# EasyEDA Pro project usbhub.epro

# Schematic Schematic1
Board Name: Board1; Create Date: 2024-12-30; Page Name: P1; Project Name: usb; Schematic Name: Schematic1; Update Date: 2025-01-01; Company: 嘉立创EDA; Page Size: A4; Version: V1.0
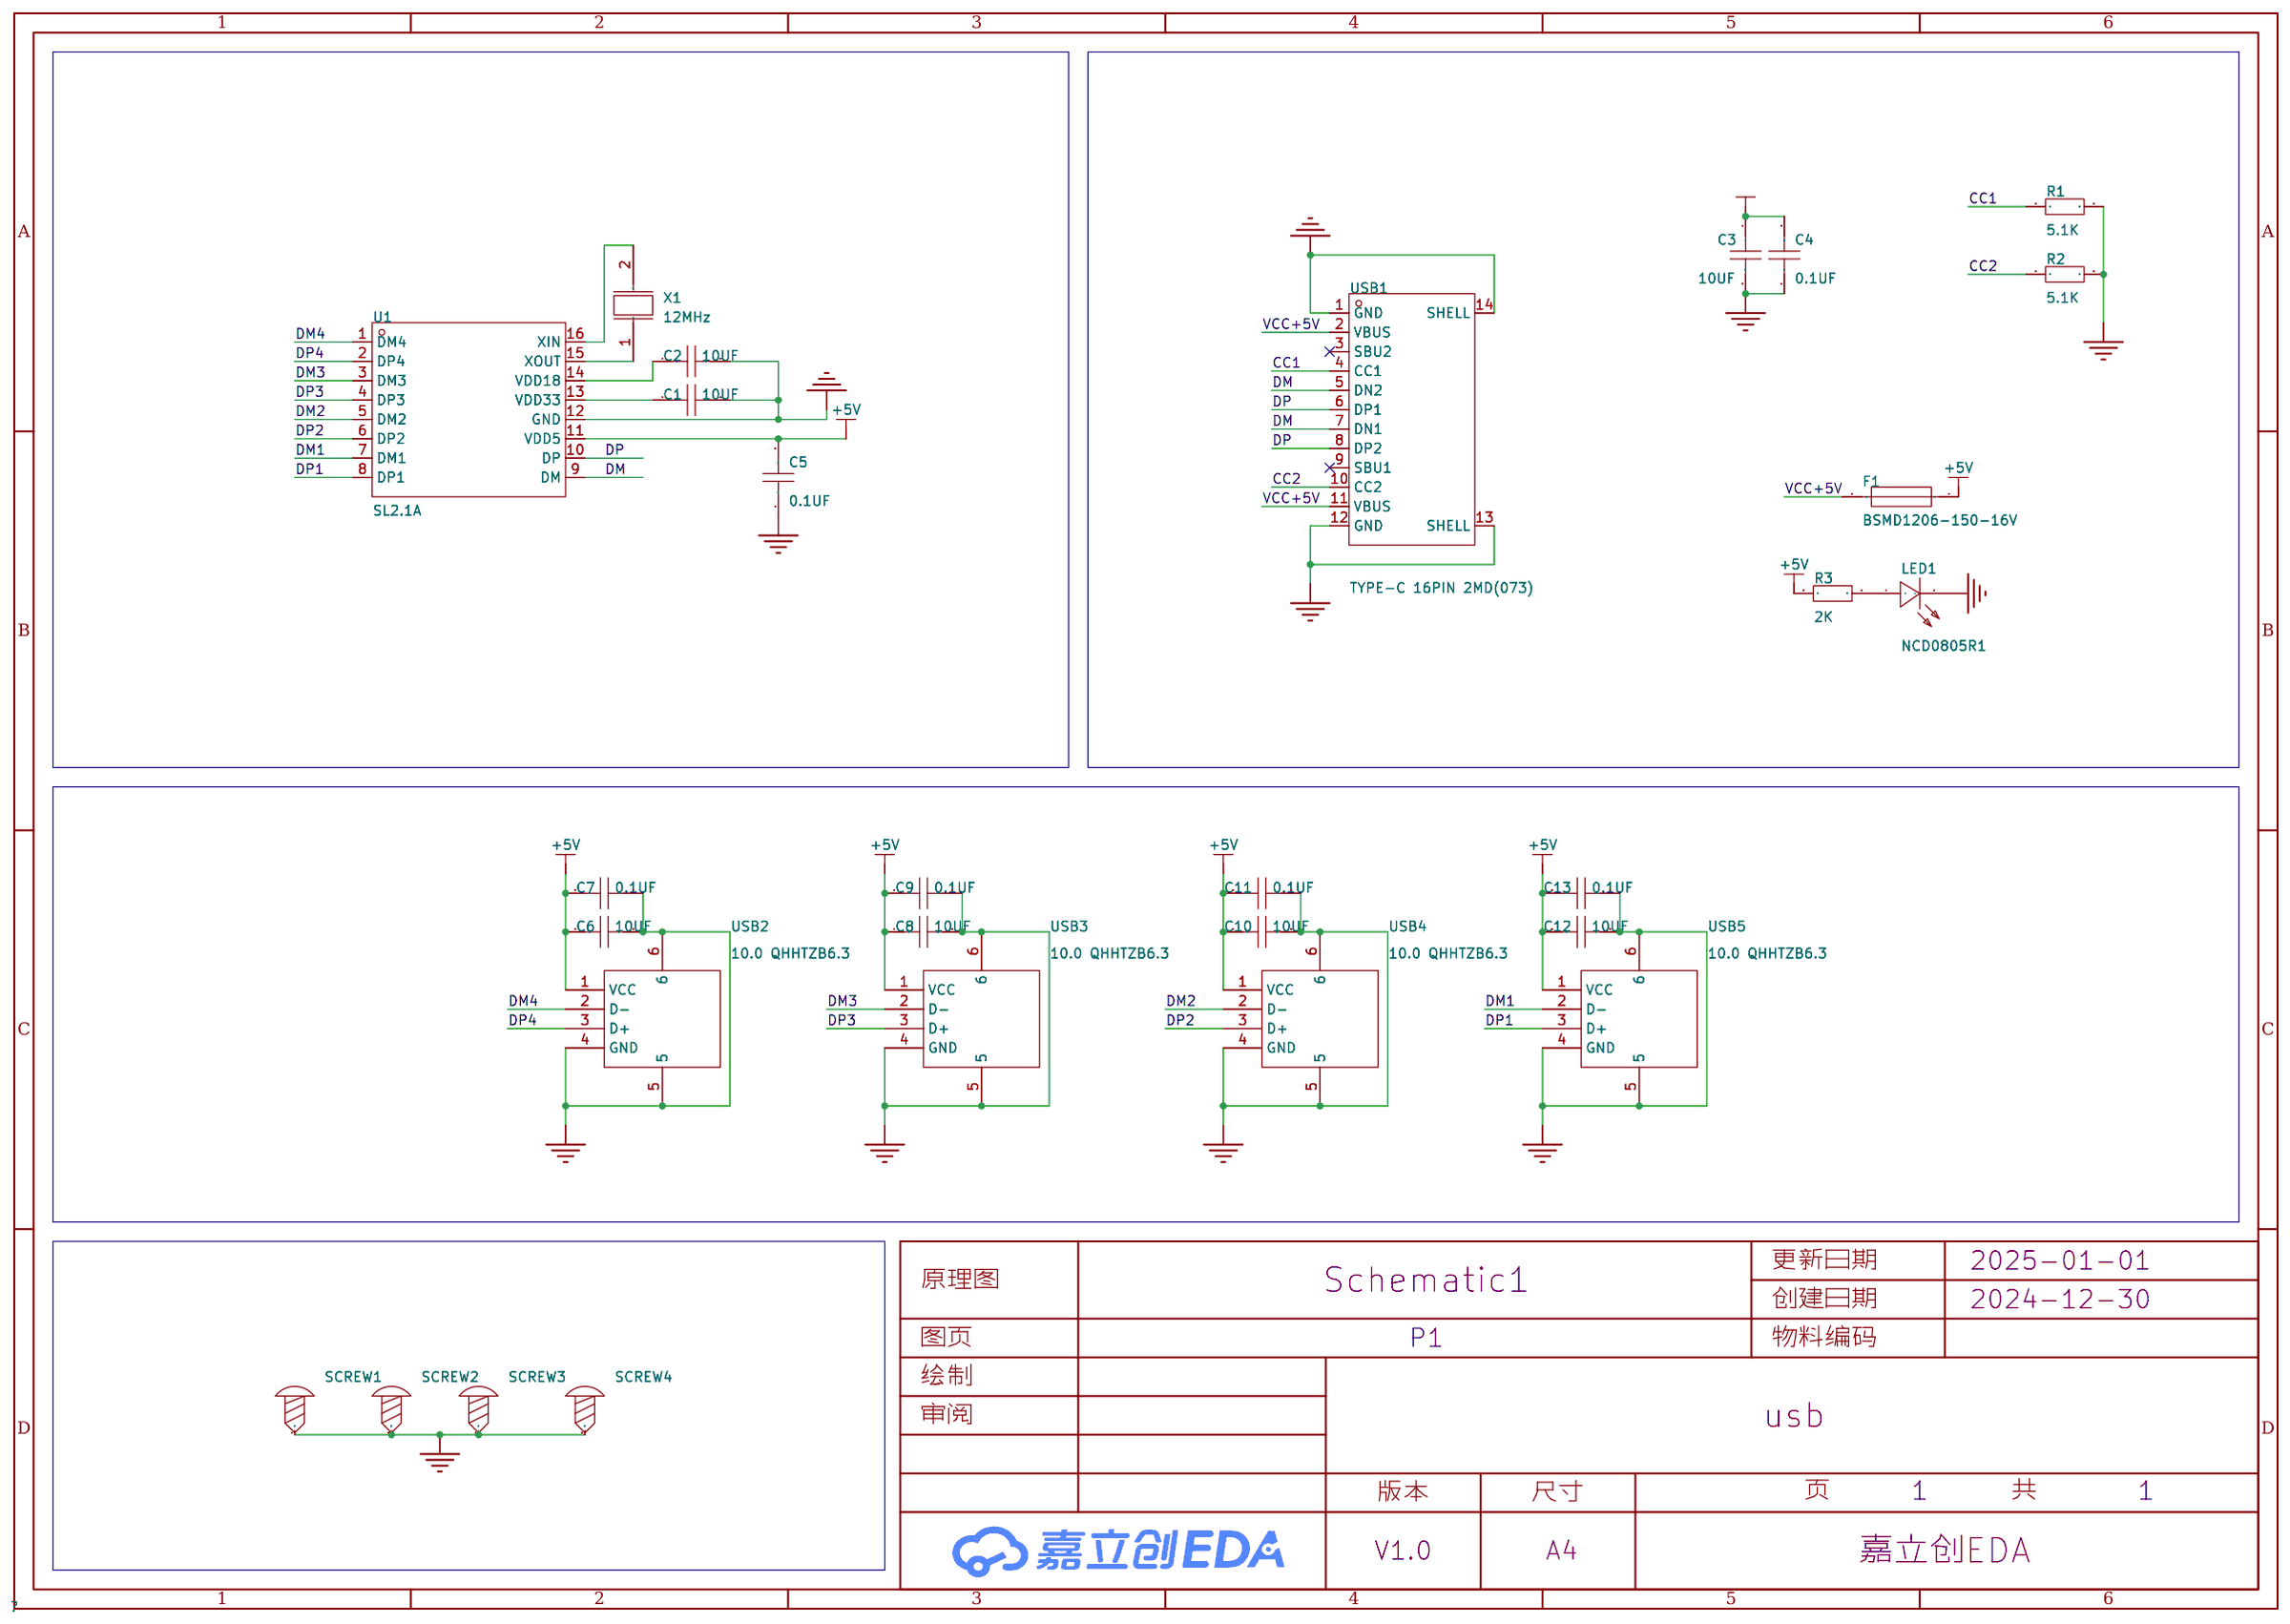
[diagram p0: schematic sheet]

## Parts
C1  10UF  [C0805]
C2  10UF  [C0805]
C3  10UF  [C0805]
C4  0.1UF  [C0805]
C5  0.1UF  [C0805]
C6  10UF  [C0805]
C7  0.1UF  [C0805]
C8  10UF  [C0805]
C9  0.1UF  [C0805]
C10  10UF  [C0805]
C11  0.1UF  [C0805]
C12  10UF  [C0805]
C13  0.1UF  [C0805]
F1  BSMD1206-150-16V  [F1206]
LED1  NCD0805R1  [LED0805-R-RD]
R1  5.1K  [R0805]
R2  5.1K  [R0805]
R3  2K  [R0805]
SCREW1  -  [M2螺丝]
SCREW2  -  [M2螺丝]
SCREW3  -  [M2螺丝]
SCREW4  -  [M2螺丝]
U1  SL2.1A  [SOP-16_L10.0-W3.9-P1.27-LS6.0-BL]
USB1  TYPE-C 16PIN 2MD(073)  [USB-C-SMD_TYPE-C-6PIN-2MD-073]
USB2  10.0 QHHTZB6.3  [USB-A-TH_10.0QHHTZB6.3]
USB3  10.0 QHHTZB6.3  [USB-A-TH_10.0QHHTZB6.3]
USB4  10.0 QHHTZB6.3  [USB-A-TH_10.0QHHTZB6.3]
USB5  10.0 QHHTZB6.3  [USB-A-TH_10.0QHHTZB6.3]
X1  12MHz  [CRYSTAL-SMD_L5.0-W3.2-1-A]

## Library data of the parts
C1-C13 = CAP_0805: Supplier Footprint: 0805
F1 = BSMD1206-150-16V: 最大电压:16V;最大电流:40A;保持电流:1.5A;跳闸电流:3A;; LCSC Part Name: 16V 1.5A 1206自恢复; Supplier Part: C883133; Manufacturer: BHFUSE(佰宏); Supplier Footprint: 1206; JLCPCB Part Class: 扩展库; Datasheet: https://atta.szlcsc.com/upload/public/pdf/source/20230512/E419278EC8529AAF514173EF221BCF4B.pdf; Supplier: LCSC; Operating Voltage (Max): 16V; Current Rating (Max): 40A; Hold Current: 1.5A; Trip Current: 3A; Power Dissipation: 1W; Resistance - Initial (Ri) (Min): 25mΩ; Resistance - Post Trip (R1) (Max): 130mΩ; Maximum Time to Trip: 300ms; Operating Temperature: -40℃~+85℃
LED1 = NCD0805R1: 灯头类型:-;发光颜色:红色;正向电压(VF):1.6V~2.6V;功率:65mW;正向电流:20mA;主波长:615nm~630nm;二极管配置:独立二极管;透镜颜色:无色透明透镜;色温:-;发光强度:67mcd~195mcd;发光角度:130°;载带方式:-;工作温度:-30℃~+85℃;; Supplier Part: C84256; Manufacturer: 国星光电; Supplier Footprint: 0805; JLCPCB Part Class: 基础库; Datasheet: https://atta.szlcsc.com/upload/public/pdf/source/20200820/C84256_F0A75A43B3EAD75808600A0514C76B99.pdf; Supplier: LCSC; Emitted Color: 红色; Forward Voltage (VF): 1.6V~2.6V; Power Dissipation: 65mW; Forward Current: 20mA; Dominant Wavelength: 615nm~630nm; Diode Configuration: 独立二极管; Lens Color: 无色透明透镜; Luminous Intensity: 67mcd~195mcd; Viewing Angle: 130°; Operating Temperature: -30℃~+85℃
R1-R3 = Res_0805: Supplier Footprint: 0805
SCREW1-SCREW4 = M2螺丝: Supplier Footprint: 插件
U1 = SL2.1A: SL2.1A是一颗高集成度,高性能,低功耗的USB2.0集线器主控芯片，支持USB2.0高速(480MHz),全速(12MHz)和低速模式(1.5MHz)，内置12MHz晶体振荡器。; LCSC Part Name: USB2.0高速4端口HUB控制器; Supplier Part: C192893; Manufacturer: CoreChips(和芯润德); Supplier Footprint: SOP-16; JLCPCB Part Class: 扩展库; Datasheet: https://atta.szlcsc.com/upload/public/pdf/source/20180522/C192893_624110D24898D57AAC785E3DF98EA862.pdf; Supplier: LCSC
USB1 = TYPE-C 16PIN 2MD(073): 连接器类型:Type-C;标准:USB 3.1;公母:母;安装方式:卧贴;触点数量:16P;端口数量:1;额定电流 - 电源:5A;工作温度范围:-25℃~+85℃;; LCSC Part Name: Type-C 母 卧贴; Supplier Part: C2765186; Manufacturer: SHOU HAN(首韩); Supplier Footprint: SMD; JLCPCB Part Class: 扩展库; Datasheet: https://atta.szlcsc.com/upload/public/pdf/source/20211123/39B17C16241EAC15C5E277BDA434118E.pdf; Supplier: LCSC; Connector Type: Type-C; Standard: USB 3.1; Gender: 母; Mounting Style: 卧贴; Number of Contacts: 16P; Number of Ports: 1; Current Rating - Power (Max): 5A; Operating Temperature Range: -25℃~+85℃; Rated Voltage (Max): 5V; Connect-Disconnect Life: 5千次; Core Colour: 黑色
USB2-USB5 = 10.0 QHHTZB6.3: 连接器类型:Type-A;标准:USB 2.0;公母:母;安装方式:卧贴;触点数量:4P;端口数量:1;额定电流 - 电源:1.5A;工作温度范围:-25℃~+85℃;; LCSC Part Name: Type-A 母 卧贴; Supplier Part: C668591; Manufacturer: SHOU HAN(首韩); Supplier Footprint: SMD; JLCPCB Part Class: 扩展库; Datasheet: https://atta.szlcsc.com/upload/public/pdf/source/20200618/C668591_4974797655F912CB13E5351AD3DDB1B7.pdf; Supplier: LCSC; Connector Type: Type-A; Standard: USB 2.0; Gender: 母; Mounting Style: 卧贴; Number of Contacts: 4P; Number of Ports: 1; Current Rating - Power (Max): 1.5A; Rated Voltage (Max): 30V; Connect-Disconnect Life: 5千次; Length: 10mm; Core Colour: 黑色; Operating Temperature Range: -25℃~+85℃
X1 = G5312000202090: 晶振类型:贴片晶振;频率:12MHz;常温频差:±20ppm;外接负载电容:20pF;; LCSC Part Name: 12MHz ±20ppm 20pF; Supplier Part: C479171; Manufacturer: JGHC(晶光华); Supplier Footprint: SMD5032; JLCPCB Part Class: 扩展库; Datasheet: https://atta.szlcsc.com/upload/public/pdf/source/20200102/C479172_02E461FA3A6D6D7CC97069C24BD4D6B6.pdf; Supplier: LCSC; Crystal Type: 贴片晶振; Normal temperature Frequency Tolerance: ±20ppm; External load capacitor: 20pF; Equivalent Series Resistance (ESR): 90Ω; Operating Temperature: -40℃~+85℃

## Nets
+5V: C5.2 C6.1 C7.2 C8.1 C9.2 C10.1 C11.2 C12.1 C13.2 F1.2 R3.2 U1.11(VDD5) USB2.1(VCC) USB3.1(VCC) USB4.1(VCC) USB5.1(VCC)
GND: C1.2 C2.2 C3.2 C4.1 C5.1 C6.2 C7.1 C8.2 C9.1 C10.2 C11.1 C12.2 C13.1 LED1.2(-) R1.2 R2.2 SCREW1.1 SCREW2.1 SCREW3.1 SCREW4.1 U1.12(GND) USB1.1(GND) USB1.12(GND) USB1.13(SHELL) USB1.14(SHELL) USB2.4(GND) USB2.5 USB2.6 USB3.4(GND) USB3.5 USB3.6 USB4.4(GND) USB4.5 USB4.6 USB5.4(GND) USB5.5 USB5.6
VCC+5V: C3.1 C4.2 F1.1 USB1.2(VBUS) USB1.11(VBUS)
CC1: R1.1 USB1.4(CC1)
CC2: R2.1 USB1.10(CC2)
DM: U1.9(DM) USB1.5(DN2) USB1.7(DN1)
DM1: U1.7(DM1) USB5.2(D-)
DM2: U1.5(DM2) USB4.2(D-)
DM3: U1.3(DM3) USB3.2(D-)
DM4: U1.1(DM4) USB2.2(D-)
DP: U1.10(DP) USB1.6(DP1) USB1.8(DP2)
DP1: U1.8(DP1) USB5.3(D+)
DP2: U1.6(DP2) USB4.3(D+)
DP3: U1.4(DP3) USB3.3(D+)
DP4: U1.2(DP4) USB2.3(D+)
$1N795: C1.1 U1.13(VDD33)
$1N799: C2.1 U1.14(VDD18)
$1N892: U1.15(XOUT) X1.1
$1N896: U1.16(XIN) X1.2
$1N2196: LED1.1(+) R3.1

Not connected (* = marked no-connect by the designer): USB1 3(SBU2)* 9(SBU1)*

# Board PCB1
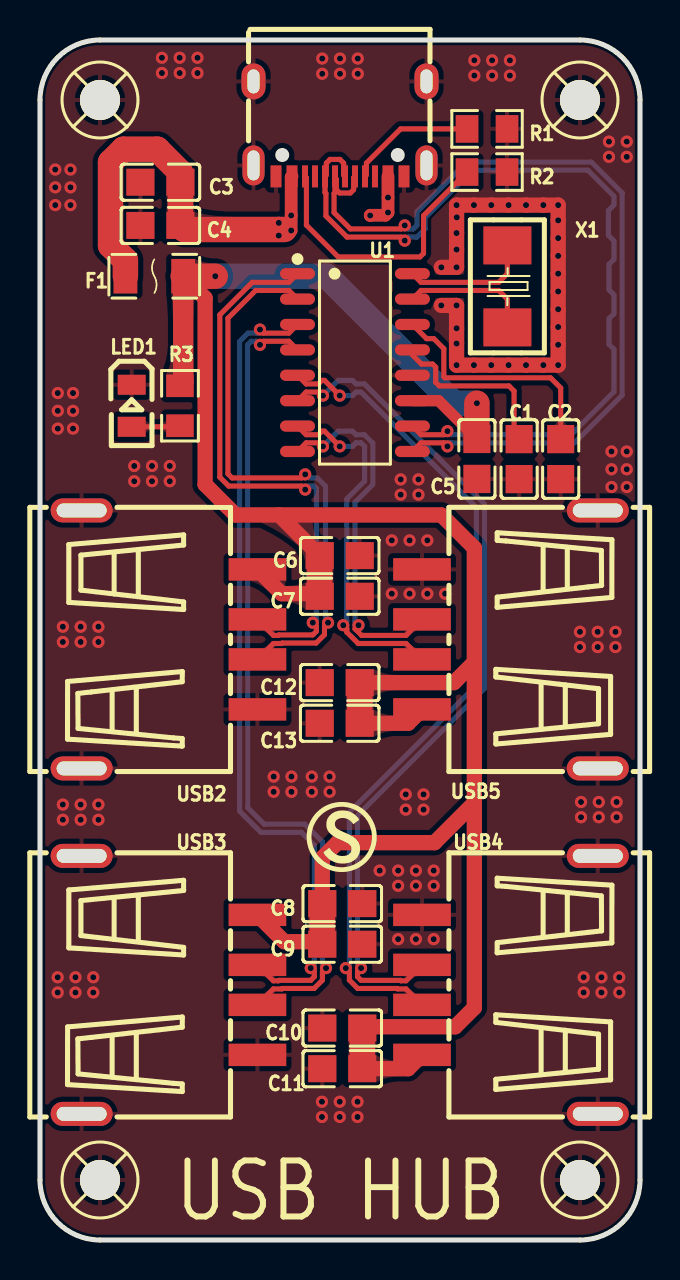
[diagram p1: board, top side]
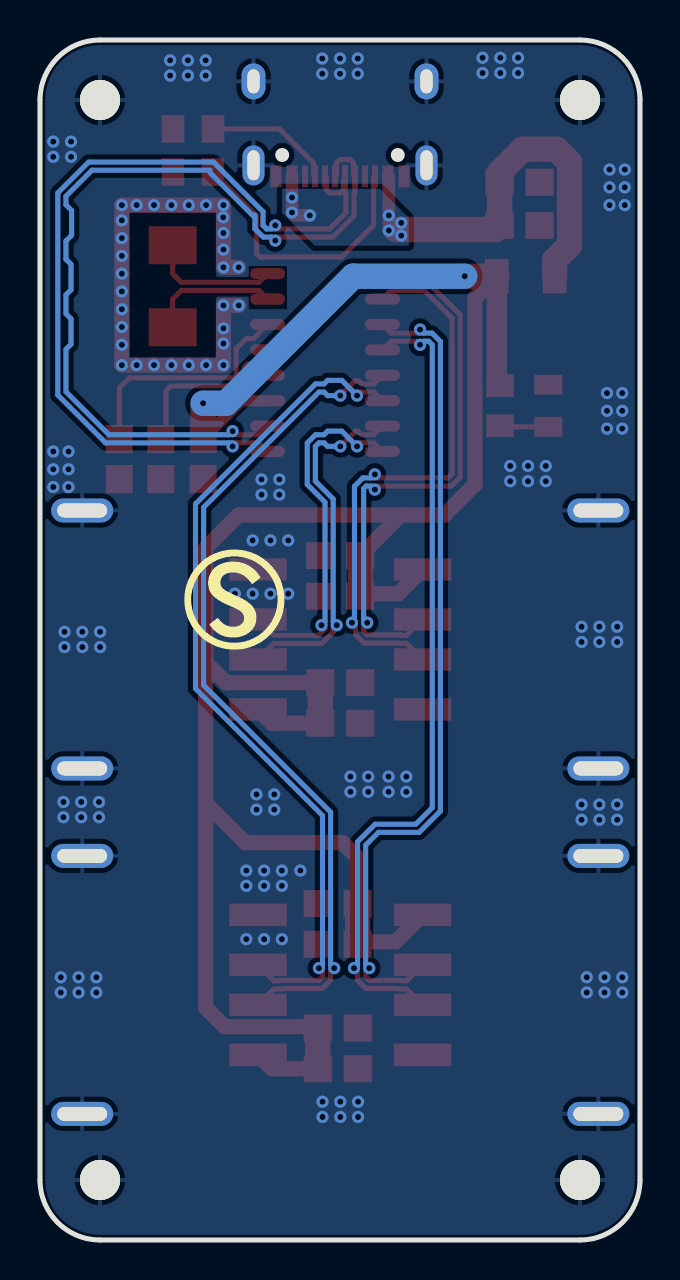
[diagram p2: board, bottom side, seen from below]

Outline 30 x 60 mm; copper layers: Top Layer, Bottom Layer. Coordinates in mm from the lower left corner of the outline.
Outline path: 0,57 0,3 arc(0.88,0.88) 3,0 27,0 arc(29.12,0.88) 30,3 30,57 arc(29.12,59.12) 27,60 3,60 arc(0.88,59.12) 0,57
Stack: Top Layer 0.035mm / Dielectric1 1.51mm FR4 er 4.5 / Bottom Layer 0.035mm

## Design rules (mm)
net DM4: DP4
net DP4: DP4
net DM3: DP3
net DP3: DP3
net DM2: DP2
net DP2: DP2
net DM1: DP1
net DP1: DP1
net $1N896: DP6
net $1N892: DP6
net DP: DP5
net DM: DP5
template: 自定义配置
spacing copperThickness1oz (default): track to track 0.102, other pairs 0.152 to 0.3
spacing copperThickness2oz: track to track 0.203, other pairs 0.152 to 0.3
track width copperThickness1oz (default): min 0.127, default 0.254, max 2.54
track width copperThickness2oz: min 0.203, default 0.254, max 2.54
differential pair differentialPair (default): width min 0.127, default 0.254, max 2.54; gap min 0.152, default 0.152
via viaSize (default): diameter min 0.5, default 0.61, max 10; hole min 0.3, default 0.305, max 6.299

## Placement (name value [footprint] x y rotation side)
C1  10UF  [C0805]  23.96 39.05 270 top
C2  10UF  [C0805]  26.03 39.05 270 top
C3  10UF  [C0805]  6.02 52.89 180 top
C4  0.1UF  [C0805]  6.02 50.73 0 top
C5  0.1UF  [C0805]  21.84 39.05 90 top
C6  10UF  [C0805]  14.99 34.22 0 top
C7  0.1UF  [C0805]  14.99 32.19 180 top
C8  10UF  [C0805]  15.11 16.82 0 top
C9  0.1UF  [C0805]  15.11 14.79 180 top
C10  10UF  [C0805]  15.11 10.6 180 top
C11  0.1UF  [C0805]  15.11 8.56 0 top
C12  10UF  [C0805]  14.99 27.87 180 top
C13  0.1UF  [C0805]  14.99 25.84 0 top
F1  BSMD1206-150-16V  [F1206]  5.72 48.19 0 top
LED1  NCD0805R1  [LED0805-R-RD]  4.59 41.71 270 top
R1  5.1K  [R0805]  22.35 55.56 0 top
R2  5.1K  [R0805]  22.35 53.4 0 top
R3  2K  [R0805]  7 41.71 90 top
SCREW1  -  [M2螺丝]  3 57 0 top
SCREW2  -  [M2螺丝]  27 3 0 top
SCREW3  -  [M2螺丝]  27 57 0 top
SCREW4  -  [M2螺丝]  3 3 0 top
U1  SL2.1A  [SOP-16_L10.0-W3.9-P1.27-LS6.0-BL]  15.75 43.87 270 top
USB1  TYPE-C 16PIN 2MD(073)  [USB-C-SMD_TYPE-C-6PIN-2MD-073]  15 55.56 180 top
USB2  10.0 QHHTZB6.3  [USB-A-TH_10.0QHHTZB6.3]  6.48 30.03 270 top
USB3  10.0 QHHTZB6.3  [USB-A-TH_10.0QHHTZB6.3]  6.48 12.76 270 top
USB4  10.0 QHHTZB6.3  [USB-A-TH_10.0QHHTZB6.3]  23.5 12.76 90 top
USB5  10.0 QHHTZB6.3  [USB-A-TH_10.0QHHTZB6.3]  23.5 30.03 90 top
X1  12MHz  [CRYSTAL-SMD_L5.0-W3.2-1-A]  23.37 47.68 90 top

## Footprints (pads in the part's own frame, mm; a bottom-side part is the same pattern mirrored in y, then rotated)
C0805
  rect 1.41x1.35 smd: 1(-1,0) 2(1,0)
CRYSTAL-SMD_L5.0-W3.2-1-A
  rect 1.9x2.4 smd: 1(-2.05,0) 2(2.05,0)
F1206
  rect 1.19x1.728 smd: 1(-1.445,0) 2(1.445,0)
LED0805-R-RD
  rect 1x1.399 smd: 1(1.05,0) 2(-1.05,0)
M2螺丝
  round 2 hole 2: 1(0,0)
R0805
  rect 1.133x1.377 smd: 1(-1,0) 2(1,0)
SOP-16_L10.0-W3.9-P1.27-LS6.0-BL
  oval 0.56x1.745 smd: 1(-4.445,-2.873) 2(-3.175,-2.873) 3(-1.905,-2.873) 4(-0.635,-2.873) 5(0.635,-2.873) 6(1.905,-2.873) 7(3.175,-2.873) 8(4.445,-2.873) 9(4.445,2.873) 10(3.175,2.873) 11(1.905,2.873) 12(0.635,2.873) 13(-0.635,2.873) 14(-1.905,2.873) 15(-3.175,2.873) 16(-4.445,2.873)
USB-A-TH_10.0QHHTZB6.3
  rect 1.12x2.88 smd: 1(-3.5,4.395) 2(-1,4.395) 3(1,4.395) 4(3.5,4.395)
  oval 1.2x3.1 hole 0.7x2.5: 5(-6.45,-4.395) 6(6.45,-4.395)
USB-C-SMD_TYPE-C-6PIN-2MD-073
  rect 0.55x1.1 smd: 1(-3.2,2.375) 2(-2.4,2.375) 11(2.4,2.375) 12(3.2,2.375)
  rect 0.3x1.1 smd: 3(-1.75,2.375) 4(-1.25,2.375) 5(-0.75,2.375) 6(-0.25,2.375) 7(0.25,2.375) 8(0.75,2.375) 9(1.25,2.375) 10(1.75,2.375)
  oval 1.1x2 hole 0.6x1.5: 13(-4.325,1.825) 14(4.325,1.825)
  oval 1.2x1.8 hole 0.6x1.2: 13(-4.325,-2.375) 14(4.325,-2.375)

## Nets
As in the schematic.

Pads without a net: USB1 3 9

## Via types
v1: diameter 0.61, hole 0.305, Top Layer to Bottom Layer, 179 vias
v2: diameter 0.762, hole 0.305, Top Layer to Bottom Layer, 2 vias

## Routing (per net, layer and track width the routed paths; a pad name or vN(x,y) marks a point on that pad's centre or on a via; arc(x,y) is an arc through that point)
+5V: length 125.6
  Top Layer w0.559: C5.2 19.93,41.97 U1.11
  Top Layer w0.762: F1.2 8.25,47.09 8.25,37.78 9.78,36.25 11.95,36.25 ; C12.1 20.7,27.87 21.72,28.89 ; 11.95,36.25 20.07,36.25 21.72,34.6 21.72,28.89 ; 11.95,36.25 C6.1 ; C9.2 13.99,14.92 12.21,14.92 USB3.1 ; 21.72,28.89 21.72,21.86 ; 21.72,21.86 21.72,11.62 20.76,10.66 16.18,10.66 C10.1 ; 21.72,21.86 19.73,19.87 14.88,19.87 14.11,19.11 14.11,16.95 ; C11.2 18.41,8.56 USB4.1 ; USB5.1 18.41,25.84 C13.2 ; C7.2 13.86,32.31 12.09,32.31 USB2.1
  Top Layer w1.016: F1.2 7.16,42.87 R3.2
  Top Layer w1.27: v2(21.84,41.84) C5.2 ; C8.1 C9.2 ; C6.1 C7.2 ; C10.1 C11.2 ; F1.2 v2(8.76,48.19) ; C12.1 C13.2
  Bottom Layer w1.27: v2(21.84,41.84) 20.69,41.84 14.34,48.19 v2(8.76,48.19)
GND: length 25.8
  Top Layer w0.762: v1(20.06,46.73) v1(20.83,46.73) v1(20.83,45.59) v1(20.83,44.82) v1(20.83,43.74) v1(21.7,43.74) v1(22.56,43.74) v1(23.43,43.74) v1(24.3,43.74) v1(25.17,43.74) v1(25.91,43.74) v1(25.91,44.76) v1(25.91,45.65) v1(25.91,46.54) v1(25.91,47.43) v1(25.91,48.32) v1(25.91,49.2) v1(25.91,50.09) v1(25.91,50.98) v1(25.91,51.75) v1(24.3,51.75) v1(23.43,51.75) v1(22.56,51.75) v1(21.7,51.75) v1(20.83,51.75) v1(20.83,50.35) v1(20.83,49.52) v1(20.83,48.63) v1(20.07,48.63)
  vias: v1(0.76,53.52) v1(0.76,52.63) v1(0.76,51.75) v1(0.89,42.35) v1(0.89,41.46) v1(0.89,40.57) v1(0.88,13.14) v1(0.88,12.38) v1(1.14,30.66) v1(1.14,29.9) v1(1.14,21.77) v1(1.14,21.01) v1(1.52,53.52) v1(1.52,52.63) v1(1.52,51.75) v1(1.65,42.35) v1(1.65,41.46) v1(1.65,40.57) v1(1.77,13.14) v1(1.77,12.38) v1(2.03,30.66) v1(2.03,29.9) v1(2.03,21.77) v1(2.03,21.01) v1(2.66,13.14) v1(2.66,12.38) v1(2.92,30.66) v1(2.92,29.9) v1(2.92,21.77) v1(2.92,21.01) v1(4.71,38.7) v1(4.71,37.94) v1(5.6,38.7) v1(5.6,37.94) v1(6.1,59.11) v1(6.1,58.35) v1(6.49,38.7) v1(6.49,37.94) v1(6.99,59.11) v1(6.99,58.35) v1(7.87,59.11) v1(7.87,58.35) v1(11.68,23.17) v1(11.68,22.41) v1(12.57,23.17) v1(12.57,22.41) v1(13.59,23.17) v1(13.59,22.41) v1(14.11,59.07) v1(14.11,58.31) v1(14.1,6.91) v1(14.1,6.15) v1(14.48,23.17) v1(14.48,22.41) v1(15,59.07) v1(15,58.31) v1(14.99,6.91) v1(14.99,6.15) v1(15.89,59.07) v1(15.89,58.31) v1(15.88,6.91) v1(15.88,6.15) v1(16.98,18.47) v1(17.59,34.98) v1(17.59,32.31) v1(17.91,18.47) v1(17.91,17.71) v1(17.91,15.04) v1(18.03,38.03) v1(18.03,37.27) v1(18.29,22.28) v1(18.29,21.52) v1(18.48,34.98) v1(18.48,32.31) v1(18.8,18.47) v1(18.8,17.71) v1(18.8,15.04) v1(18.92,38.03) v1(18.92,37.27) v1(19.18,22.28) v1(19.18,21.52) v1(19.37,34.98) v1(19.37,32.31) v1(19.69,18.47) v1(19.69,17.71) v1(19.69,15.04) v1(20.26,32.31) v1(20.84,51.13) v1(21.72,58.98) v1(21.72,58.22) v1(22.61,58.98) v1(22.61,58.22) v1(23.5,58.98) v1(23.5,58.22) v1(25.17,51.75) v1(27,30.41) v1(27,29.65) v1(27.05,21.9) v1(27.05,21.14) v1(27.18,13.14) v1(27.18,12.38) v1(27.88,30.41) v1(27.88,29.65) v1(27.94,21.9) v1(27.94,21.14) v1(28.07,13.14) v1(28.07,12.38) v1(28.45,54.92) v1(28.45,54.16) v1(28.57,39.43) v1(28.57,38.54) v1(28.57,37.65) v1(28.77,30.41) v1(28.77,29.65) v1(28.83,21.9) v1(28.83,21.14) v1(28.96,13.14) v1(28.96,12.38) v1(29.34,54.92) v1(29.34,54.16) v1(29.34,39.43) v1(29.34,38.54) v1(29.34,37.65)
VCC+5V: length 23.7
  Top Layer w0.635: v1(12.56,50.47) v1(12.56,51.23) 12.56,53.14 USB1.11 ; USB1.2 v1(17.4,52.12) v1(17.4,51.38) 17.26,51.24 16.52,51.24 v1(16.51,51.23)
  Top Layer w1.27: 12.22,50.53 7.22,50.53 C4.2 C3.1 7.02,53.38 5.86,54.54 4.18,54.54 3.53,53.89 3.53,49.73 4.27,48.99 F1.1
  vias: v1(11.94,50.86) v1(11.94,50.22)
CC1: length 6.4
  Top Layer w0.254: R1.1 18.03,55.56 16.32,53.85 16.32,53.25 USB1.4
CC2: length 14
  Top Layer w0.254: R2.1 19.18,51.22 19.18,49.33 19,49.15 14.91,49.15 13.32,50.74 13.32,53.11 USB1.10
DM: length 43.4
  Top Layer w0.254: v1(18.24,50.73) 18.06,50.55 15.52,50.55 14.7,51.37 14.7,52.33 14.75,52.38 USB1.7 14.77,53.16 14.77,53.08 14.82,53.03 14.82,52.51 14.98,52.35 15.52,52.35 15.68,52.51 15.68,53.11 USB1.5 ; v1(20.37,39.68) 20.19,39.86 19.05,39.86 U1.9
  Bottom Layer w0.254: v1(20.37,39.68) 20.55,39.86 26.72,39.86 29.11,42.25 29.11,52.35 27.57,53.9 21.33,53.9 18.85,51.42 18.85,50.73 18.67,50.55 18.41,50.55 v1(18.24,50.73)
DM1: length 18.2
  Top Layer w0.254: v1(15.16,30.74) 15.34,30.56 15.34,30.39 15.91,29.83 18.3,29.83 USB5.2 ; v1(14.99,39.68) 14.22,40.44 14.1,40.44 13.92,40.26 13.31,40.26 U1.7
  Bottom Layer w0.254: v1(15.16,30.74) 15.34,30.92 15.34,37.05 16.23,37.94 16.23,39.68 16.05,39.86 15.8,39.86 15.62,39.68 v1(14.99,39.68)
DM2: length 42.5
  Top Layer w0.254: v1(15.29,13.59) 15.47,13.42 15.47,12.99 15.89,12.58 17.86,12.58 17.88,12.55 18.3,12.55 USB4.2 ; v1(14.99,42.22) 14.22,42.98 14.1,42.98 13.92,42.8 13.31,42.8 U1.5
  Bottom Layer w0.254: v1(14.99,42.22) 15.62,42.22 15.8,42.4 16.05,42.4 21.82,36.63 21.82,27.74 15.47,21.39 15.47,13.77 v1(15.29,13.59)
DM3: length 41.3
  Top Layer w0.254: v1(11,45.52) 11.18,45.34 12.44,45.34 U1.3 ; USB3.2 11.67,12.96 11.92,12.96 11.95,12.98 13.54,12.98 13.72,13.16 13.72,13.42 v1(13.54,13.59)
  Bottom Layer w0.254: v1(13.54,13.59) 13.72,13.77 13.72,19.74 13.07,20.38 11.04,20.38 9.98,21.44 9.98,44.93 10.4,45.34 10.82,45.34 v1(11,45.52)
DM4: length 28.7
  Top Layer w0.254: USB2.2 11.67,30.23 11.92,30.23 11.95,30.25 13.64,30.25 13.82,30.43 13.82,30.69 v1(13.64,30.87) ; U1.1 12.44,47.88 10.62,47.88 8.99,46.26 8.99,38.14 9.43,37.7 13.08,37.7 v1(13.26,37.52)
  Bottom Layer w0.254: v1(13.64,30.87) 13.82,31.04 13.82,37.57 13.69,37.7 13.44,37.7 v1(13.26,37.52)
DP: length 43.4
  Top Layer w0.254: U1.10 19.05,40.26 20.19,40.26 v1(20.37,40.44) ; v1(18.24,49.97) 18.06,50.15 15.35,50.15 14.3,51.2 14.3,52.33 14.25,52.38 USB1.8 14.32,53.25 14.32,53.85 14.48,54.01 14.51,54.03 14.99,54.03 15.18,53.85 15.18,53.25 USB1.6
  Bottom Layer w0.254: 19.25,51.25 19.25,51.12 ; 19.25,51.12 21.5,53.36 ; 19.25,51.12 19.25,50.56 18.84,50.15 18.41,50.15 v1(18.24,49.97) ; v1(20.37,40.44) 20.55,40.26 26.55,40.26 28.7,42.41 28.7,44.54 28.45,44.79 28.45,46.06 28.7,46.31 28.7,47.26 28.45,47.51 28.45,48.78 28.7,49.03 28.7,49.95 28.42,50.24 28.42,51.48 28.7,51.76 28.7,52.19 27.4,53.49 21.5,53.49
DP1: length 18.2
  Top Layer w0.254: v1(14.15,39.68) 13.97,39.86 13.31,39.86 U1.8 ; v1(15.93,30.74) 15.75,30.56 16.08,30.23 18.3,30.23 USB5.3
  Bottom Layer w0.254: v1(14.15,39.68) 14.91,40.44 15.62,40.44 15.8,40.26 16.22,40.26 16.64,39.85 16.64,37.78 15.75,36.89 15.75,30.92 v1(15.93,30.74)
DP2: length 42.5
  Top Layer w0.254: U1.6 13.31,42.4 13.97,42.4 v1(14.15,42.22) ; USB4.3 18.3,12.96 18.05,12.96 18.03,12.98 16.05,12.98 15.88,13.16 15.88,13.42 v1(16.05,13.59)
  Bottom Layer w0.254: v1(16.05,13.59) 15.88,13.77 15.88,21.22 22.22,27.57 22.22,36.8 16.22,42.8 15.8,42.8 15.62,42.98 14.91,42.98 v1(14.15,42.22)
DP3: length 41.3
  Top Layer w0.254: USB3.3 11.67,12.55 12.09,12.55 12.11,12.58 13.7,12.58 14.12,12.99 14.12,13.42 v1(14.3,13.59) ; v1(11,44.76) 11.18,44.94 12.44,44.94 U1.4
  Bottom Layer w0.254: v1(11,44.76) 10.82,44.94 10.57,44.94 10.39,44.76 10.39,21.61 11.21,20.79 13.24,20.79 14.12,19.91 14.12,13.77 v1(14.3,13.59)
DP4: length 28.7
  Top Layer w0.254: v1(13.26,38.28) 13.08,38.1 9.6,38.1 9.4,38.31 9.4,46.09 10.78,47.48 12.44,47.48 U1.2 ; v1(14.4,30.87) 14.22,30.69 14.22,30.27 13.81,29.85 12.11,29.85 12.09,29.83 11.67,29.83 USB2.3
  Bottom Layer w0.254: v1(13.26,38.28) 13.44,38.1 13.86,38.1 14.28,37.69 14.28,30.99 v1(14.4,30.87)
$1N795: length 9
  Top Layer w0.254: U1.13 18.62,44.25 19.08,43.8 19.63,43.8 19.78,43.64 19.78,42.88 19.96,42.7 23.45,42.7 23.7,42.45 23.7,40.3 C1.1
$1N799: length 12.1
  Top Layer w0.254: U1.14 19.33,45.07 19.69,45.07 20.19,44.56 20.19,43.16 20.24,43.11 25.53,43.11 26.03,42.6 C2.1
$1N892: length 6.5
  Top Layer w0.254: U1.15 19.05,47.48 22.94,47.48 23.37,47.05 X1.1
$1N896: length 6.5
  Top Layer w0.254: X1.2 23.37,48.32 22.94,47.88 19.05,47.88 U1.16
$1N2196: length 2.4
  Top Layer w0.254: LED1.1 6.95,40.66 R3.1

## Copper pours and planes (outline as drawn; the poured copper is in the pictures)
GND on Top Layer: 0,60 30,60 30,-0.23 0,-0.23
GND on Bottom Layer: 0,60 30,60 30,-0.2 0,-0.2
VCC+5V on Bottom Layer: 11.56,52.56 17.91,52.56 17.91,49.71 11.56,49.71

Small or netless copper shapes (teardrops, artwork), in the pictures only: 40 on Top Layer, 4 on Bottom Layer

## Text on the board
Top Silkscreen Layer: USB HUB
